# Altium schematic sheet PCI-104.SchDoc
size 420 x 297 mm
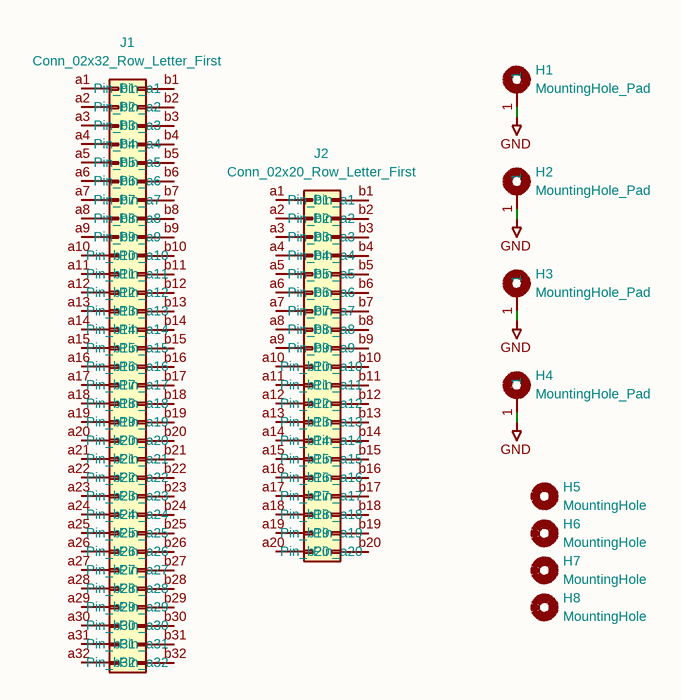
[diagram p0: PCI-104.SchDoc]

## Parts
H1  MountingHole_Pad  [MountingHole_3.2mm_M3_Pad]
H2  MountingHole_Pad  [MountingHole_3.2mm_M3_Pad]
H3  MountingHole_Pad  [MountingHole_3.2mm_M3_Pad]
H4  MountingHole_Pad  [MountingHole_3.2mm_M3_Pad]
H5  MountingHole  [MountingHole_2mm]
H6  MountingHole  [MountingHole_2mm]
H7  MountingHole  [MountingHole_2mm]
H8  MountingHole  [MountingHole_2mm]
J1  Conn_02x32_Row_Letter_First  [PinSocket_2x32_P2.54mm_Vertical]
J2  Conn_02x20_Row_Letter_First  [PinSocket_2x20_P2.54mm_Vertical]

## Nets
GND: H1.1 H2.1 H3.1 H4.1

Not connected (* = marked no-connect by the designer): J1 a1(Pin_a1) a2(Pin_a2) a3(Pin_a3) a4(Pin_a4) a5(Pin_a5) a6(Pin_a6) a7(Pin_a7) a8(Pin_a8) a9(Pin_a9) a10(Pin_a10) a11(Pin_a11) a12(Pin_a12) a13(Pin_a13) a14(Pin_a14) a15(Pin_a15) a16(Pin_a16) a17(Pin_a17) a18(Pin_a18) a19(Pin_a19) a20(Pin_a20) a21(Pin_a21) a22(Pin_a22) a23(Pin_a23) a24(Pin_a24) a25(Pin_a25) a26(Pin_a26) a27(Pin_a27) a28(Pin_a28) a29(Pin_a29) a30(Pin_a30) a31(Pin_a31) a32(Pin_a32) b1(Pin_b1) b2(Pin_b2) b3(Pin_b3) b4(Pin_b4) b5(Pin_b5) b6(Pin_b6) b7(Pin_b7) b8(Pin_b8) b9(Pin_b9) b10(Pin_b10) b11(Pin_b11) b12(Pin_b12) b13(Pin_b13) b14(Pin_b14) b15(Pin_b15) b16(Pin_b16) b17(Pin_b17) b18(Pin_b18) b19(Pin_b19) b20(Pin_b20) b21(Pin_b21) b22(Pin_b22) b23(Pin_b23) b24(Pin_b24) b25(Pin_b25) b26(Pin_b26) b27(Pin_b27) b28(Pin_b28) b29(Pin_b29) b30(Pin_b30) b31(Pin_b31) b32(Pin_b32); J2 a1(Pin_a1) a2(Pin_a2) a3(Pin_a3) a4(Pin_a4) a5(Pin_a5) a6(Pin_a6) a7(Pin_a7) a8(Pin_a8) a9(Pin_a9) a10(Pin_a10) a11(Pin_a11) a12(Pin_a12) a13(Pin_a13) a14(Pin_a14) a15(Pin_a15) a16(Pin_a16) a17(Pin_a17) a18(Pin_a18) a19(Pin_a19) a20(Pin_a20) b1(Pin_b1) b2(Pin_b2) b3(Pin_b3) b4(Pin_b4) b5(Pin_b5) b6(Pin_b6) b7(Pin_b7) b8(Pin_b8) b9(Pin_b9) b10(Pin_b10) b11(Pin_b11) b12(Pin_b12) b13(Pin_b13) b14(Pin_b14) b15(Pin_b15) b16(Pin_b16) b17(Pin_b17) b18(Pin_b18) b19(Pin_b19) b20(Pin_b20)

## Notes on the sheet
- 1
- 2
- 3
- 4
- 5
- 6
- 7
- 8
- A
- B
- C
- D
- E
- Title: PCI-104 Template
- File: PCI-104.kicad_sch
- Sheet: /
- GU Orbit
- F
- KiCad E.D.A.  kicad (5.1.4)-1
- Size: A3
- Date: 2024-11-25
- Rev: B
- Id: 1/1

## Library data of the parts
H1-H4 = MountingHole_Pad: Description: Mounting Hole with connection; Value: MountingHole_Pad; Footprint: MountingHole:MountingHole_3.2mm_M3_Pad
H5-H8 = MountingHole: Description: Mounting Hole without connection; Value: MountingHole; Footprint: MountingHole:MountingHole_2mm
J1 = Conn_02x32_Row_Letter_First: Description: Generic connector, double row, 02x32, row letter first pin numbering scheme (pin number consists of a letter for the row and a number for the pin index in this row. a1, ..., aN; b1, ..., bN), script generated (kicad-library-utils/schlib/autogen/connector/); Value: Conn_02x32_Row_Letter_First; Footprint: Connector_PinSocket_2.54mm:PinSocket_2x32_P2.54mm_Vertical
J2 = Conn_02x20_Row_Letter_First: Description: Generic connector, double row, 02x20, row letter first pin numbering scheme (pin number consists of a letter for the row and a number for the pin index in this row. a1, ..., aN; b1, ..., bN), script generated (kicad-library-utils/schlib/autogen/connector/); Value: Conn_02x20_Row_Letter_First; Footprint: Connector_PinSocket_2.54mm:PinSocket_2x20_P2.54mm_Vertical